# EAGLE design HighPowerWS2801_v2 (EAGLE 8.0.0)
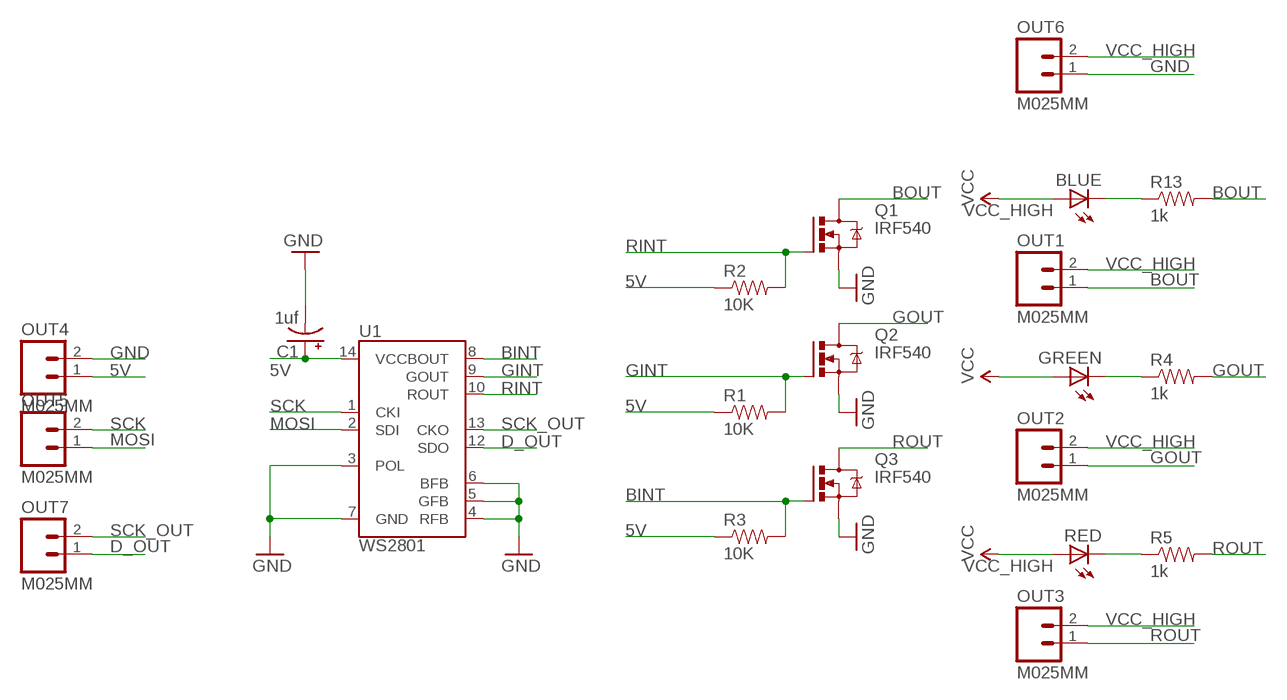
[diagram p0: schematic, sheet 1]

## Parts
BLUE  LED3MM  [LED3MM]
C1  1uf  10UF-25V-20%(PTH)  [CPOL-RADIAL-10UF-25V]
GREEN  LED3MM  [LED3MM]
OUT1  M025MM  [SCREWTERMINAL-5MM-2]
OUT2  M025MM  [SCREWTERMINAL-5MM-2]
OUT3  M025MM  [SCREWTERMINAL-5MM-2]
OUT4  M025MM  [SCREWTERMINAL-5MM-2]
OUT5  M025MM  [SCREWTERMINAL-5MM-2]
OUT6  M025MM  [SCREWTERMINAL-5MM-2]
OUT7  M025MM  [SCREWTERMINAL-5MM-2]
Q1  IRF540  [TO220BV]
Q2  IRF540  [TO220BV]
Q3  IRF540  [TO220BV]
R1  10K  RESISTORPTH-1/4W  [AXIAL-0.4]
R2  10K  RESISTORPTH-1/4W  [AXIAL-0.4]
R3  10K  RESISTORPTH-1/4W  [AXIAL-0.4]
R4  1k  RESISTORPTH-1/4W  [AXIAL-0.4]
R5  1k  RESISTORPTH-1/4W  [AXIAL-0.4]
R13  1k  RESISTORPTH-1/4W  [AXIAL-0.4]
RED  LED3MM  [LED3MM]
U1  WS2801  [SOP-14]

## Nets
5V: C1.1(+) OUT4.1 R1.P$1 R2.P$1 R3.P$1 U1.14(VCC)
BINT: Q3.G R3.P$2 U1.8(BOUT)
BOUT: OUT1.1 Q1.D R13.P$2
D_OUT: OUT7.1 U1.12(SDO)
GINT: Q2.G R1.P$2 U1.9(GOUT)
GND: C1.2(-) OUT4.2 OUT6.1 Q1.S Q2.S Q3.S U1.3(POL) U1.4(RFB) U1.5(GFB) U1.6(BFB) U1.7(GND)
GOUT: OUT2.1 Q2.D R4.P$2
MOSI: OUT5.1 U1.2(SDI)
N$1: BLUE.K(C) R13.P$1
N$2: GREEN.K(C) R4.P$1
N$6: R5.P$1 RED.K(C)
RINT: Q1.G R2.P$2 U1.10(ROUT)
ROUT: OUT3.1 Q3.D R5.P$2
SCK: OUT5.2 U1.1(CKI)
SCK_OUT: OUT7.2 U1.13(CKO)
VCC_HIGH: BLUE.A GREEN.A OUT1.2 OUT2.2 OUT3.2 OUT6.2 RED.A ; supply symbol labelled VCC

## Library data of the parts
BLUE GREEN RED = SparkFun-LED:LED: LEDs Standard schematic elements and footprints for 5mm, 3mm, 1206, and 0603 sized LEDs. 5mm - Spark Fun Electronics SKU : COM-00529 (and others)
C1 = SparkFun-Capacitors:10UF-25V-20%(PTH): CAP-08440; PROD_ID: CAP-08440
OUT1-OUT7 = SparkFun-Connectors:M02: Standard 2-pin 0.1" header. Use with - straight break away headers ( PRT-00116) - right angle break away headers (PRT-00553) - swiss pins (PRT-00743) - machine pins (PRT-00117) - female headers (PRT-00115) Molex polarized connector foot print use with: PRT-08233 with associated crimp pins and housings. 2.54_SCREWTERM for use with PRT-10571. 3.5mm Screw Terminal footprints for PRT-08084 5mm Screw Terminal footprints for use with PRT-08433
Q1-Q3 = transistor-power:IRF540: HEXFET Power MOSFET
R1-R5 R13 = SparkFun-Resistors:RESISTOR: Resistor Basic schematic elements and footprints for 0603, 1206, and PTH resistors.
U1 = SparkFun-DigitalIC:WS2801: WS2801 3 Channel Constant Current LED Driver with programmable PWM outputs. Datasheet: http://www.sparkfun.com/datasheets/Components/LED/WS2801.pdf

## Board
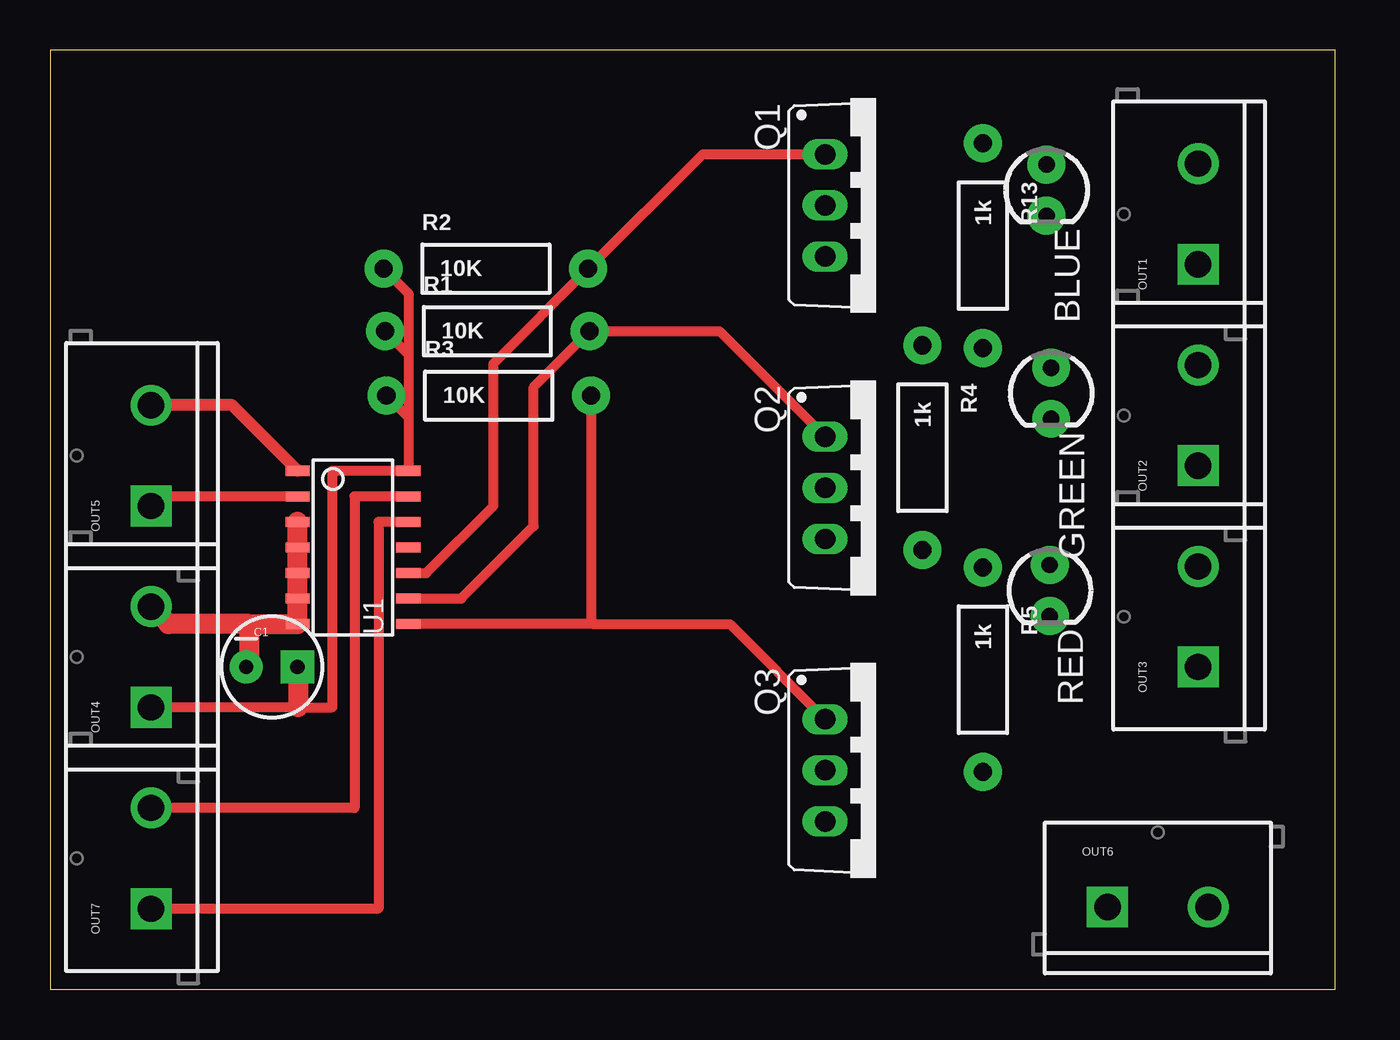
[diagram p1: board, top side]
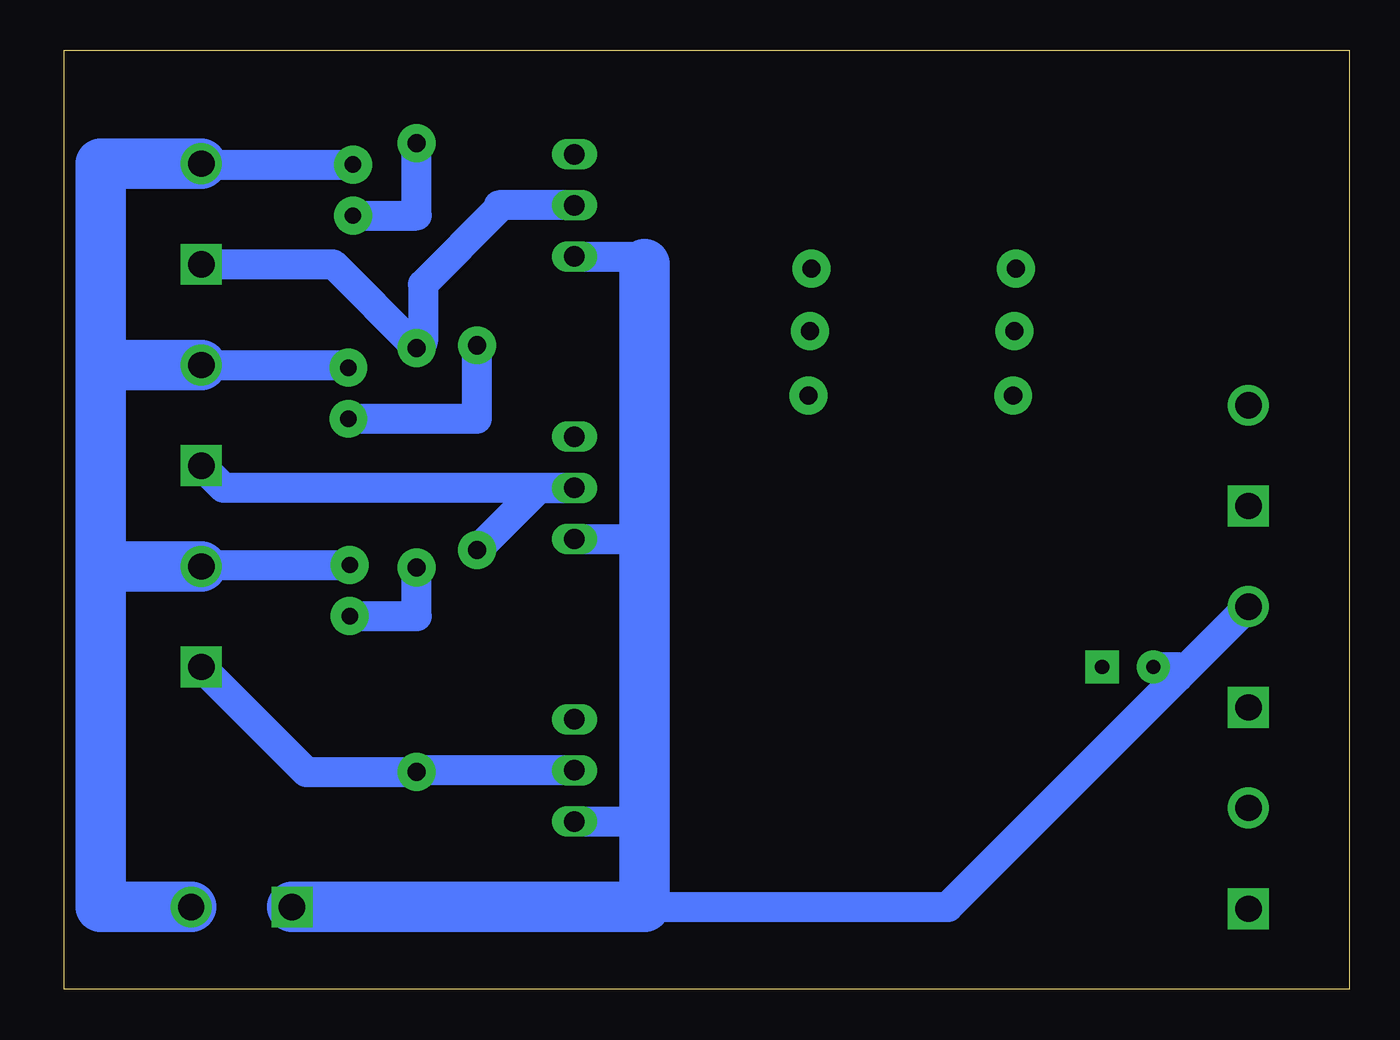
[diagram p2: board, bottom side, seen from below]

Size 63.8 x 46.63 mm. Coordinates in mm from the lower left corner, seen from the top.
Outline: 0,0 63.8,0 63.8,46.63 0,46.63 0,0
Copper layers (1*16): Top 0.035mm / dielectric 1.5mm / Bottom 0.035mm
Design rules "OthermillDRC_1_64_v2": minimum track width 16mil, minimum drill 31mil, track to track 0.39878125mm, track to pad 0.39878125mm, pad to pad 0.39878125mm, via to via 0.39878125mm, smd to smd 0mil, copper to edge 0mil, drill to drill 1mil, minimum pad ring 0mil, minimum via ring 15mil, stop-mask expansion 1mil, vias tented up to drill 30mil, thermal gap 10mil

### Footprints (pad centres in the part's own frame; a part is rotated, then mirrored left to right if it is on the bottom)
LED3MM = drill 0.813 pad 1.88: A -1.27,0; K 1.27,0
CPOL-RADIAL-10UF-25V = drill 0.7 pad 1.651 square: 1 1.27,0 | drill 0.7 pad 1.651: 2 -1.27,0
SCREWTERMINAL-5MM-2 = drill 1.3 pad 2.032 square: 1 0,0 | drill 1.3 pad 2.032: 2 5,0
TO220BV = drill 1.016 long: D 0,-2.54; G -2.54,-2.54; S 2.54,-2.54
AXIAL-0.4 = drill 0.9 pad 1.88: P$1 -5.08,0; P$2 5.08,0
SOP-14 = smd 0.5 x 1.2: 1 -3.81,-2.75; 2 -2.54,-2.75; 3 -1.27,-2.75; 4 0,-2.75; 5 1.27,-2.75; 6 2.54,-2.75; 7 3.81,-2.75; 8 3.81,2.75; 9 2.54,2.75; 10 1.27,2.75; 11 0,2.75; 12 -1.27,2.75; 13 -2.54,2.75; 14 -3.81,2.75

### Placement (x,y rotation side)
BLUE  49.47,39.69 270 top
C1  11,16 0 top
GREEN  49.7,29.6 270 top
OUT1  57,36 90 top
OUT2  57,26 90 top
OUT3  57,16 90 top
OUT4  5,14 90 top
OUT5  5,24 90 top
OUT6  52.5,4.08 0 top
OUT7  5,4 90 top
Q1  41.01,38.93 270 top
Q2  41.01,24.9 270 top
Q3  41.01,10.87 270 top
R1  21.7,32.68 0 top
R2  21.63,35.78 0 top
R3  21.77,29.48 0 top
R4  43.31,26.9 270 top
R5  46.31,15.87 270 top
R13  46.31,36.93 270 top
RED  49.63,19.8 270 top
U1  15.03,21.94 270 top

### Tracks (layer width: path | path; a pad name or v marks a point on that pad's centre or on a via)
5V
  Top 0.5: OUT4.1 12.3,14 14,14 14,25.75 U1.14 17.78,28.39 | 17.78,28.39 R3.P$1 | 17.78,31.52 R1.P$1 | 17.78,31.52 17.78,28.39 | R2.P$1 17.78,34.55 17.78,31.52
  Top 1: C1.1 12.3,16 12.3,14
BINT
  Top 0.5: 27,18.13 U1.8 | 27,18.13 33.75,18.13 Q3.G | R3.P$2 26.85,18.28 27,18.13
BOUT
  Bottom 1.5: Q1.D 42.23,38.93 42.23,38.77 46,35 46,32.16 R13.P$2 50.46,36 OUT1.1
D_OUT
  Top 0.5: U1.12 16.3,23.21 16.3,4 OUT7.1
GINT
  Top 0.5: Q2.G 33.23,32.68 R1.P$2 24,29.9 24,23 20.4,19.4 U1.9
GND
  Top 1: OUT4.2 5.87,18.13 9.9,18.13 | 9.9,18.13 U1.7 U1.6 U1.5 U1.4 U1.3 | C1.2 9.9,16 9.9,18.13
  Bottom 1.5: Q1.S 35,36.39 35,36 | Q2.S 35,22.36 35,22 | Q3.S 35,8.33 35,9 | 35,4.08 19.92,4.08 8.5,15.5 | 8.5,15.5 OUT4.2 | C1.2 8.5,16 8.5,15.5
  Bottom 2.5: OUT6.1 35,4.08 35,9 35,22 35,36
GOUT
  Bottom 1.5: OUT2.1 55.9,24.9 Q2.D 40.23,24.9 R4.P$2
MOSI
  Top 0.5: U1.2 5.48,24.48 OUT5.1
N$1
  Bottom 1.5: BLUE.K 46.31,38.42 R13.P$1
N$2
  Bottom 1.5: GREEN.K 43.31,28.33 R4.P$1
N$6
  Bottom 1.5: RED.K 46.31,18.53 R5.P$1
RINT
  Top 0.5: U1.10 18.67,20.67 22,24 22,31.07 R2.P$2 32.4,41.47 Q1.G
ROUT
  Bottom 1.5: Q3.D 46.31,10.87 R5.P$2 51.79,10.79 OUT3.1
SCK
  Top 0.6: U1.1 9.03,29 OUT5.2
SCK_OUT
  Top 0.5: U1.13 15.1,24.48 15.1,9 OUT7.2
VCC_HIGH
  Bottom 1.5: OUT3.2 56.93,21.07 RED.A | OUT2.2 49.7,31 GREEN.A | OUT1.2 56.96,40.96 BLUE.A
  Bottom 2.5: OUT6.2 62,4.08 62,21 | 62,21 OUT3.2 | 62,21 62,31 | 62,31 OUT2.2 | 62,31 62,41 OUT1.2